# Altium project plug.PrjPcb
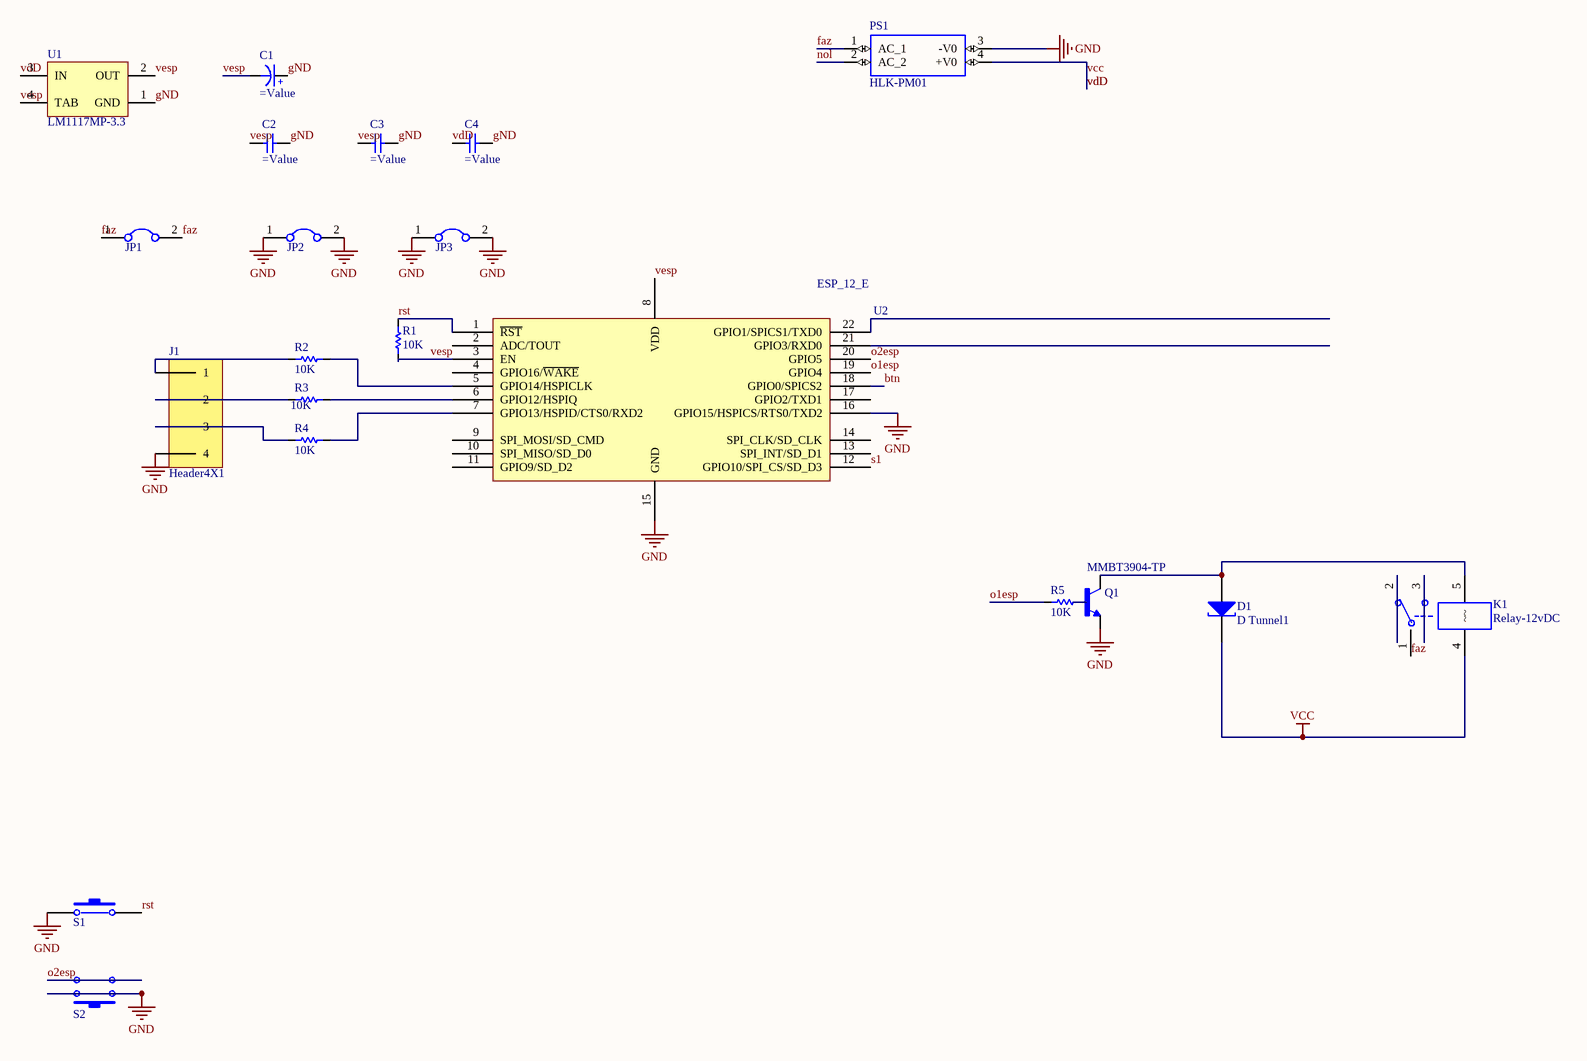
[diagram p0: plug.SchDoc]
1 sheet, 21 parts. Net scope: global (net labels, ports and power ports of the same name join across sheets).
Board file: plug.PcbDoc

## Sheet plug.SchDoc
size A3

### Parts
C1  (no value)  [ELEC-CAP-RAD10-20]
C2  (no value)  [CAP 0805]
C3  (no value)  [CAP 1206]
C4  (no value)  [CAP 1206]
D1  D Tunnel1  [3.2X1.6X1.1]
J1  Header4X1  [HEADER 4X1]
JP1  Jumper  [Header 2X1]  (value not drawn)
JP2  Jumper  [Header 2X1]  (value not drawn)
JP3  Jumper  [Header 2X1]  (value not drawn)
K1  Relay-12vDC  [Relays]
PS1  HLK-PM01  [HLKPM01]
Q1  MMBT3904-TP  [SOT23-3]
R1  10K  [RES 1206 (3216X08L)]
R2  10K  [RES 1206 (3216X08L)]
R3  10K  [RES 1206 (3216X08L)]
R4  10K  [RES 1206 (3216X08L)]
R5  10K  [RES 1206 (3216X08L)]
S1  PB-2pin  [PB-2pin]  (value not drawn)
S2  PUSH BUTTON DOUBLE  [PUSH BUTTON]  (value not drawn)
U1  LM1117MP-3.3  [MP04A_N]
U2  ESP_12_E  [ESP_12_E]

### Nets
gND: C1.2(+) C2.2(-) C3.2(-) C4.2(-) J1.4 JP2.1 JP2.2 JP3.1 JP3.2 PS1.3(-V0) Q1.2(E) S1.1 S2.1 S2.2 U1.1(GND) U2.15(GND) U2.16(GPIO15/HSPICS/RTS0/TXD2)
vcc: C4.1(+) D1.2(K) K1.4 PS1.4(+V0) U1.3(IN)  [also labelled vdD]
btn: U2.18(GPIO0/SPICS2)
faz: JP1.1 JP1.2 K1.1(COM) PS1.1(AC_1)
nol: PS1.2(AC_2)
o1esp: R5.1 U2.19(GPIO4)
o2esp: S2.3 S2.4 U2.20(GPIO5)
rst: R1.2 S1.2 U2.1(~{RST})
s1: U2.12(GPIO10/SPI_CS/SD_D3)
vesp: C1.1(-) C2.1(+) C3.1(+) R1.1 U1.2(OUT) U1.4(TAB) U2.3(EN) U2.8(VDD)
NetD1_1: D1.1(A) K1.5 Q1.3(C)
NetJ1_1: J1.1 R2.1
NetJ1_2: J1.2 R3.1
NetJ1_3: J1.3 R4.1
NetQ1_1: Q1.1(B) R5.2
NetR2_2: R2.2 U2.5(GPIO14/HSPICLK)
NetR3_2: R3.2 U2.6(GPIO12/HSPIQ)
NetR4_2: R4.2 U2.7(GPIO13/HSPID/CTS0/RXD2)

Not connected (* = marked no-connect by the designer): K1 2(NC) 3(NO); U2 2(ADC/TOUT) 4(GPIO16/~{WAKE}) 9(SPI_MOSI/SD_CMD) 10(SPI_MISO/SD_D0) 11(GPIO9/SD_D2) 13(SPI_INT/SD_D1) 14(SPI_CLK/SD_CLK) 17(GPIO2/TXD1) 21(GPIO3/RXD0) 22(GPIO1/SPICS1/TXD0)

### Library data of the parts
C1 = Capacitor Electrolytic: Electrolytic Capacitor
C2-C4 = Capacitor
D1 = D Tunnel1: Tunnel Diode - RLC Model; Published: 8-Jun-2000; LatestRevisionDate: 17-Jul-2002; LatestRevisionNote: Re-released for DXP Platform.; PackageVersion: Feb-2002; PackageReference: 3.2X1.6X1.1; Publisher: Altium Limited; PackageDescription: SM LED; 2 Flat Leads
K1 = Relay-05vDC: Relay-05vDC-240AC 5A; Designer: Seyed Mohsen Ghasemain; ComponentLinkURL: www.picpars.com
PS1 = HLK-PM01: <b>Ultra-compact power module</b><p> Source: <a href="https://datasheet.lcsc.com/szlcsc/1906201102_HI-LINK-HLK-PM03_C209904.pdf"> Datasheet </a>; Package: Package Analog Devices; MF: Hi-link; Availability: Unavailable; Value: *; MP: hlk-pm01; Price: None; SnapEDA_Link: https://www.snapeda.com/parts/hlk-pm01/Hi-link/view-part/2875605/?ref=snap
Q1 = MMBT3904-TP: Bipolar _BJT_ Transistor NPN 40V 200mA 300MHz 350mW Surface Mount SOT-23; MF: Micro Commercial; Value: *; MP: MMBT3904-TP; Package: SOT-23 Micro Commercial; Price: None; Availability: Unavailable; SnapEDA_Link: https://www.snapeda.com/parts/MMBT3904-TP/Micro%20Commercial/view-part/805928/?ref=snap
R1-R5 = Resistor: Tolerance: 5%; Power: 1/4 W; Value: 10K
S1 = PB-2pin: Switch; E-mail: picpars@gmail.com; Designer: Seyed Mohsen Ghasemian; Publisher: www.picpars.com; WEB: www.picpars.com
S2 = PUSH BUTTON DOUBLE: Switch
U1 = LM1117MP-3.3: 800mA Low-Dropout Linear Regulator; Manufacturer: National Semiconductor; CompType: LDO IC; PackageTopMarking: XYTT*N05A; PowerWise: N; Published: 4-Dec-2008; DatasheetVersion: Apr-2006; PackageVersion: revB, Apr-2003; PackageReference: MP04A; Publisher: Altium Limited; PackageDescription: Molded SOT-223, 6.50 x 3.56 x 1.6mm Body, 4 Lead, 2.3mm Pitch; PartNumber: LM1117MP-3.3; RoHS: O; PinCount: 4; DigiKeyPartNumber: LM1117MP-3.3CT-ND; Code_JEDEC: TO-261-AA; Code_IPC: SOT223-4; ComponentLink1Description: LM1117 Datasheet; ComponentLink1URL: http://www.national.com/ds/LM/LM1117.pdf; ComponentLink2Description: LM1117 Web Page; ComponentLink2URL: http://www.national.com/pf/LM/LM1117.html; ComponentLink3Description: MP04A Package Page; ComponentLink3URL: http://www.national.com/packaging/folders/mp04a.html
U2 = ESP_12_E: ESP-12 Wi-Fi Module by AI-Thinker; IC: ESP8266-EX; Vendor: Ai-thinker